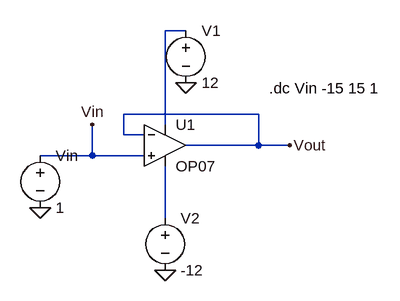
[diagram p0: schematic Voltage Follower.asc]
Voltage Follower.asc, the LTspice schematic file:
Version 4
SHEET 1 880 680
WIRE 224 -16 192 -16
WIRE 336 112 128 112
WIRE 192 128 192 -16
WIRE 128 144 128 112
WIRE 160 144 128 144
WIRE 336 160 336 112
WIRE 336 160 224 160
WIRE 384 160 336 160
WIRE 80 176 80 128
WIRE 80 176 0 176
WIRE 160 176 80 176
WIRE 192 272 192 192
FLAG 224 64 0
FLAG 0 256 0
FLAG 192 352 0
FLAG 80 128 Vin
FLAG 384 160 Vout
SYMBOL OpAmps\\OP07 192 96 R0
SYMATTR InstName U1
SYMBOL voltage 0 160 R0
WINDOW 123 0 0 Left 0
WINDOW 39 0 0 Left 0
SYMATTR InstName Vin
SYMATTR Value 1
SYMBOL voltage 192 256 R0
WINDOW 123 0 0 Left 0
WINDOW 39 0 0 Left 0
SYMATTR InstName V2
SYMATTR Value -12
SYMBOL voltage 224 -32 R0
WINDOW 123 0 0 Left 0
WINDOW 39 0 0 Left 0
SYMATTR InstName V1
SYMATTR Value 12
TEXT 352 72 Left 2 !.dc Vin -15 15 1

The netlist it stands for:
* Voltage Follower.asc
XU1 Vin Vout N001 N002 Vout LT1001  ; OP07, pins In+ In- V+ V- OUT
Vin Vin 0 1
V2 N002 0 -12
V1 N001 0 12
.dc Vin -15 15 1
.lib LTC.lib
.backanno
.end